# Altium schematic sheet Supply.SchDoc: Supply & POE
size 420 x 297 mm; Author: G.Kasprowicz; CompanyName: WUT ISE; DrawnBy: G.Kasprowicz; Organization: WUT ISE; Address1: PW ISE; Address2: Nowowiejska 15/19 00-665 Warsaw; Address3: gkasprow@gmail.com; DocumentNumber: 4; Revision: 2; SheetNumber: 4; SheetTotal: 5; ModifiedBy: -; CheckedDate: -; DivGrp: WUT ISE; Designer: G.Kasprowicz; ModifiedDate: -; ProjectName: Sensor Box
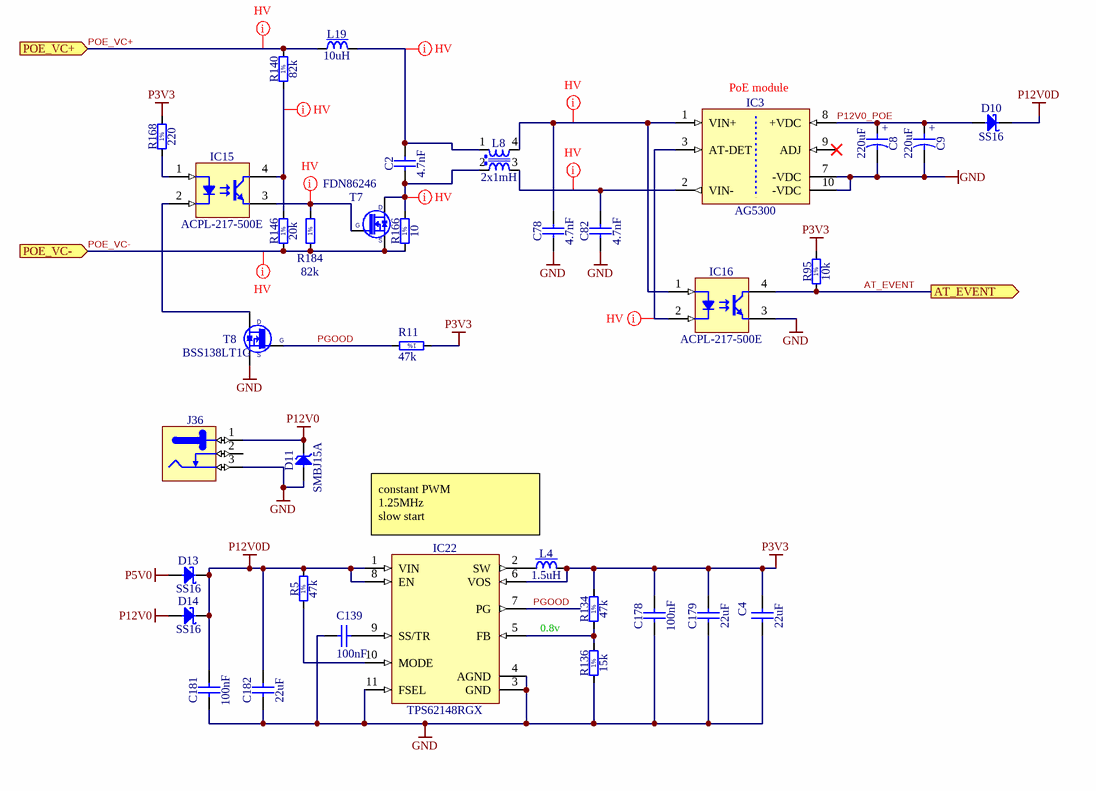
[diagram p0: Supply.SchDoc]

## Parts
C2  4.7nF  [CAPC3216X140N]
C4  22uF  [CAPC2012X135N]
C8  220uF  [CAPMP7343X430N]
C9  220uF  [CAPMP7343X430N]
C78  4.7nF  [CAPC3216X140N]
C82  4.7nF  [CAPC3216X140N]
C139  100nF  [CAPC1005X55N]
C178  100nF  [CAPC1005X55N]
C179  22uF  [CAPC2012X135N]
C181  100nF  [CAPC1005X55N]
C182  22uF  [CAPC2012X135N]
D10  SS16  [DIOM5127X229N]
D11  SMBJ15A  [DIOM5336X265N]
D13  SS16  [DIOM5127X229N]
D14  SS16  [DIOM5127X229N]
IC3  AG5300  [SILVERTEL_AG5300]
IC15  ACPL-217-500E  [SOIC127P700X242-4N]
IC16  ACPL-217-500E  [SOIC127P700X242-4N]
IC22  TPS62148RGX  [TEXAS_RGX0011A]
J36  Jack  [CLIFF_FC68148(DC-10A)]  (value not drawn)
L4  1.5uH  [IND_TDK_SPM6530]
L8  2x1mH  [IND_WURTH_WE-SL2]
L19  10uH  [IND_MURATA-PS_8400]
R5  47k  [RESC1608X55N]
R11  47k  [RESC1608X55N]
R95  10k  [RESC1005X40N]
R134  47k  [RESC1608X55N]
R136  15k  [RESC1608X55N]
R140  82k  [RESC1608X55N]
R146  20k  [RESC1005X40N]
R166  10  [RESC2012X60N]
R168  220  [RESC1608X55N]
R184  82k  [RESC1608X55N]
T7  FDN86246  [SOT95P237X112-3N]
T8  BSS138LT1G  [SOT95P240X110-3N]

## Ports
AT_EVENT (out), POE_VC+ (in), POE_VC- (in)

## Nets
GND: C4.1 C8.2 C9.2 C78.1 C82.1 C139.2 C178.1 C179.1 C181.1 C182.1 D11.2(A) IC3.7(-VDC) IC3.10(-VDC) IC16.3(E) IC22.3(GND) IC22.4(AGND) IC22.11(FSEL) J36.3 R136.1 T8.2(S)
P3V3: C4.2 C178.2 C179.2 IC22.6(VOS) L4.2 R11.1 R95.2 R134.2 R168.2
P5V0: D13.2(A)
P12V0: D11.1(C) D14.2(A) J36.1
P12V0D: C181.2 C182.2 D10.1(C) D13.1(C) D14.1(C) IC22.1(VIN) IC22.8(EN) R5.2
AT_EVENT: IC16.4(C) R95.1 ; port AT_EVENT
P12V0_POE: C8.1 C9.1 D10.2(A) IC3.8(+VDC)
PGOOD: IC22.7(PG) R11.2 T8.1(G)
POE_VC+: L19.1 R140.2 ; port POE_VC+
POE_VC-: R146.1 R166.1 R184.1 T7.2(S) ; port POE_VC-
NetC2_1: C2.1 L8.2 R166.2 T7.3(D)
NetC2_2: C2.2 L8.1 L19.2
NetC78_2: C78.2 IC3.1(VIN+) IC16.1(A) L8.4
NetC82_2: C82.2 IC3.2(VIN-) L8.3
NetC139_1: C139.1 IC22.9(SS/TR)
NetIC3_3: IC3.3(AT-DET) IC16.2(C)
NetIC15_1: IC15.1(A) R168.1
NetIC15_2: IC15.2(C) T8.3(D)
NetIC15_3: IC15.3(E) R184.2 T7.1(G)
NetIC15_4: IC15.4(C) R140.1 R146.2
NetIC22_2: IC22.2(SW) L4.1
NetIC22_5: IC22.5(FB) R134.1 R136.2
NetIC22_10: IC22.10(MODE) R5.1

Not connected (* = marked no-connect by the designer): IC3 9(ADJ)*; J36 2

## Layout directives
net class HV: NetC2_1, NetC2_2, NetC78_2, NetC82_2, NetIC3_3, NetIC15_3, NetIC15_4, POE_VC+, POE_VC-

## Notes on the sheet
- (near IC3) PoE module
- constant PWM
  1.25MHz
  slow start
- 0.8v
- Project/Equipment
- Document
- Designer
- Drawn by
- Check.by
- Copyright WUT ISE 2020.
  This documentation describes Open Hardware and is licensed under the CERN OHL v.1.2. You may redistribute and modify this documentation under the terms of the CERN OHL v.1.2. (http://ohwr.org/CERNOHL). This documentation is distributed WITHOUT ANY EXPRESS OR IMPLIED WARRANTY, INCLUDING OF MERCHANTABILITY, SATISFACTORY QUALITY AND FITNESS FOR A PARTICULAR PURPOSE. Please see the CERN OHL v.1.2 for applicable conditions.
- Contact
- File
- Last Mod.
- Print Date
- Sheet
- Size
- A3
- of
- Rev
- (in symbol CTE7343-43_220UF_16V_10%) +
- (in symbol R0402_10K_1%_0.0625W_100PPM) 1%
- (in symbol R0402_20K_1%_0.0625W_100PPM) 1%
- (in symbol R0603_15k_1%_0.1W_100PPM) 1%
- (in symbol R0603_47K_1%_0.1W_100PPM) 1%
- (in symbol R0603_82K_1%_0.1W_100PPM) 1%
- (in symbol R0603_220R_1%_0.1W_100PPM) 1%
- (in symbol R0805_10R_1%_0.125W_200PPM) 1%

## Library data of the parts
C2 C78 C82 = CAP_SMD_1206_4.7n_500V: Non-polarised capacitor; Part Number: CC1206_4.7NF_500V_10%_X7R; Part Description: SMD Multilayer Chip Ceramic Capacitor; Manufacturer: GENERIC; Manufacturer1 Part Number: C1206C472KCRACTU; Voltage: 500V; TC: X7R; Tolerance: ±10%; Table: Capacitors SMD; Component Kind: Standard; Component Type: Standard; Pin Count: 2; Value: 4.7nF; Status: Preferred; Manufacturer Part Number: CC1206_4.7NF_500V_10%_X7R; Case: 1206; Mounted: Yes; Socket: No; SMD: Yes; Manufacturer1 Example: KEMET; Manufacturer1 ComponentHeight: 1.7mm; HelpURL: \\cern.ch\dfs\Applications\Altium\Datasheets\CC1206_X7R_VISHAY_VJ.pdf; Author: GK; CreateDate: 2007-12-03; LatestRevisionDate: 2007-12-03
C4 C179 C182 = CC0805_22UF_16V_10%_X5R: Non-polarised capacitor; Part Description: SMD Multilayer Chip Ceramic Capacitor; Manufacturer: GENERIC; Manufacturer1 Part Number: C2012X5R1C226KT; Voltage: 16V; TC: X5R; Tolerance: ±10%; Part Number: CC0805_22UF_16V_10%_X5R; Component Kind: Standard; Component Type: Standard; Pin Count: 2; Value: 22uF; Status: Preferred; Manufacturer Part Number: CC0805_22UF_16V_10%_X5R; Case: 0805; Mounted: Yes; Socket: No; SMD: Yes; Sense: No; Manufacturer1 Example: TDK; Manufacturer1 ComponentHeight: 1.35mm; HelpURL: \\cern.ch\dfs\Applications\Altium\Datasheets\CC0805_X5R_TDK_C.pdf; Author: CERN DEM JLC; CreateDate: 25.10.2012; LatestRevisionDate: 25.10.2012
C8 C9 = CTE7343-43_220UF_16V_10%: Polarised capacitor; Part Description: Solid Tantalum Chip Capacitor; Manufacturer: GENERIC; Manufacturer1 Part Number: TAJE227K016R; Voltage: 16V; Tolerance: ±10%; Part Number: CTE7343-43_220UF_16V_10%; Component Kind: Standard; Component Type: Standard; Pin Count: 2; Value: 220uF; Status: Preferred; Manufacturer Part Number: CTE7343-43_220UF_16V_10%; Case: E; Mounted: Yes; Socket: No; SMD: Yes; Sense: No; Manufacturer1 Example: AVX; Manufacturer1 ComponentHeight: 4.3mm; HelpURL: \\cern.ch\dfs\Applications\Altium\Datasheets\CTE_AVX_TAJ.pdf; Author: CERN DEM JLC; CreateDate: 03.12.2007; LatestRevisionDate: 03.12.2007
C139 C178 C181 = CC0402_100NF_16V_10%_X5R: Non-polarised capacitor; Part Description: SMD Multilayer Chip Ceramic Capacitor; Manufacturer: GENERIC; Manufacturer1 Part Number: GRM155R61C104KA88D; Voltage: 16V; TC: X5R; Tolerance: ±10%; Part Number: CC0402_100NF_16V_10%_X5R; Component Kind: Standard; Component Type: Standard; Pin Count: 2; Value: 100nF; Status: None; Manufacturer Part Number: CC0402_100NF_16V_10%_X5R; Case: 0402; Mounted: Yes; Socket: No; SMD: Yes; Sense: No; Manufacturer1 Example: MURATA; Manufacturer1 ComponentHeight: 0.55mm; HelpURL: \\cern.ch\dfs\Applications\Altium\Datasheets\CC0402_X5R_MURATA_GRM.pdf; Author: CERN DEM JLC; CreateDate: 10.12.2013; LatestRevisionDate: 10.12.2013
D10 D13 D14 = SS16: Schottky Diode; Part Description: Surface Mount Schottky Barrier Rectifier; Manufacturer: VISHAY GENERAL SEMICONDUCTOR; Voltage: 60V; Power: 1A; PressFit: No; Bonding: No; Part Number: SS16; Component Kind: Standard; Component Type: Standard; Device: SS16; PackageDescription: DO-214-AC Molded Diode, Body 5.1x2.7mm, IPC Medium Density; Manufacturer Part Number: SS16; Pin Count: 2; Case: DO-214AC; Mounted: Yes; Socket: No; SMD: Yes; Sense: No; ComponentHeight: 2.29mm; HelpURL: \\cern.ch\dfs\Applications\Altium\Datasheets\SS16.pdf; Author: CERN DEM JLC; CreateDate: 15.07.2008; LatestRevisionDate: 23.08.2010
D11 = SMBJ15A: Zener Diode; Part Description: Uni-Directional Transient Voltage Suppressor Diode; Manufacturer: FAIRCHILD SEMICONDUCTOR; Voltage: 15V; Power: 600W; PressFit: No; Bonding: No; Part Number: SMBJ15A; Component Kind: Standard; Component Type: Standard; Device: SMBJ15A; PackageDescription: DO-214-AA/SMB Diode, Molded Body; 5.34mm L X 3.625mm W X 2.65mm H, IPC Medium Density; Manufacturer Part Number: SMBJ15A; Pin Count: 2; Case: DO-214AA; Mounted: Yes; Socket: No; SMD: Yes; Sense: No; ComponentHeight: 2.65mm; HelpURL: \\cern.ch\dfs\Applications\Altium\Datasheets\SMBJ.pdf; Author: CERN DEM JLC; CreateDate: 08.12.2008; LatestRevisionDate: 19.12.2011
IC3 = AG5300: Power-over-Ethernet Plus (POE+) Module; Part Description: 12V 30W Power-over-Ethernet Plus (POE+); Manufacturer: SILVERTEL; PressFit: No; Bonding: No; Part Number: AG5300; Component Kind: Standard; Component Type: Standard; Device: AG5300; PackageDescription: Power-over-Ethernet Plus (POE+) Module, Body L 57.3mm x W 18mm x H 14mm; Manufacturer Part Number: AG5300; Pin Count: 10; Mounted: Yes; Socket: No; SMD: No; Sense: No; ComponentHeight: 14mm; HelpURL: \\cern.ch\dfs\Applications\Altium\Datasheets\AG5300.pdf; Author: CERN DEM JLC; CreateDate: 20.03.2018; LatestRevisionDate: 20.03.2018
IC15 IC16 = ACPL-217-500E: Single Optocoupler; Part Description: DC Input, Half-Pitch Phototransistor Optocoupler; Manufacturer: AVAGO TECHNOLOGIES; PressFit: No; Bonding: No; Part Number: ACPL-217-500E; Component Kind: Standard; Component Type: Standard; Device: ACPL-217-500E; PackageDescription: SOIC, 1.27mm, pitch; 4 pin, 2.60mm W X 4.40mm L X 2.42mm H body, IPC Medium Density; Status: Not Recommended; Manufacturer Part Number: ACPL-217-500E; Pin Count: 4; Case: SOIC4; Mounted: Yes; Socket: No; SMD: Yes; Sense: No; ComponentHeight: 2.42mm; HelpURL: \\cern.ch\dfs\Applications\Altium\Datasheets\ACPL-217-500E.pdf; Author: CERN DEM JLC; CreateDate: 11.11.2014; LatestRevisionDate: 11.11.2014
IC22 = TPS62148RGX: 3V-17V 2A Step-Down Converter, High Accuracy, With DCS-Control; Manufacturer: TEXAS INSTRUMENTS; PressFit: No; Bonding: No; Part Number: TPS62148RGX; Component Kind: Standard; Component Type: Standard; Device: TPS62148RGX; PackageDescription: TEXAS Case Style (R-VQFN-HR-N11), 0.50mm Pitch, 11-pin, 2.00mm W X 3.00mm L X 1.00mm H Body; Part Description: 3V-17V 2A Step-Down Converter, High Accuracy, With DCS-Control; Manufacturer Part Number: TPS62148RGX; Pin Count: 11; Case: QFN14; Mounted: Yes; Socket: No; SMD: Yes; Sense: No; ComponentHeight: 1mm; HelpURL: \\cern.ch\dfs\Applications\Altium\Datasheets\TPS62148RGX.pdf; Author: CERN DEM MR; CreateDate: 08.02.2019; LatestRevisionDate: 08.02.2019
J36 = CLIFF_FC68148(DC-10A): 12V /  5A, 2.1mm Diameter Pin, DC Power Socket With  Switch. DC10A Type; Part Description: 12V/5A, 2.1mm Diameter Pin, DC Power Socket With  Switch (DC10A Type); Manufacturer: CLIFF ELECTRONIC COMPONENTS; PressFit: No; Part Number: CLIFF_FC68148(DC-10A); Component Kind: Standard; Component Type: Standard; Pin Count: 3; Family: Jack; Mounted: Yes; Socket: No; SMD: No; Sense: No; Status: None; Manufacturer Part Number: FC68148 (DC-10A); ComponentHeight: 11mm; HelpURL: \\cern.ch\dfs\Applications\Altium\Datasheets\CLIFF_FC68148(DC-10A).pdf; Author: CERN DEM JLC; CreateDate: 23/11/2010; LatestRevisionDate: 23/11/2010
L4 = IND_1.5UH_20%_TDK_SPM6530: Inductor With Core; Part Description: SMD Inductor for Power Circuits (Wound Metal), SPM Series; Manufacturer: TDK; Manufacturer Part Number: SPM6530T-1R5M100; Power: 11A; Resistance: 0.0097R; Tolerance: ±20%; Part Number: IND_1.5UH_20%_TDK_SPM6530; Component Kind: Standard; Component Type: Standard; Pin Count: 2; Value: 1.5uH; Status: None; Mounted: Yes; Socket: No; SMD: Yes; Sense: No; ComponentHeight: 3mm; HelpURL: \\cern.ch\dfs\Applications\Altium\Datasheets\IND_TDK_SPM6530.pdf; Author: CERN DEM MR; CreateDate: 08.11.2016; LatestRevisionDate: 08.11.2016
L8 = IND_1MH_50%_WURTH_WE-SL2-744222: Inductor Common Mode; Part Description: Common Mode SMD Line Filter (WE-SL2 Series); Manufacturer: WURTH ELEKTRONIK; Manufacturer Part Number: 744222; Power: 800mA; Resistance: 0.31R; Tolerance: ±50%; Part Number: IND_1MH_50%_WURTH_WE-SL2-744222; Component Kind: Standard; Component Type: Standard; Pin Count: 4; Value: 2x1mH; Status: None; Mounted: Yes; Socket: No; SMD: Yes; Sense: No; ComponentHeight: 5.3mm; HelpURL: \\cern.ch\dfs\Applications\Altium\Datasheets\IND_WURTH_WE-SL2_744222.pdf; Author: CERN DEM JLC; CreateDate: 04.06.2012; LatestRevisionDate: 15.10.2012
L19 = IND_10UH_10%_MURATA-PS_8400: Inductor With Core; Part Description: Miniature Surface Mount Power Inductor (8400 Serie); Manufacturer: MURATA POWER SOLUTIONS; Manufacturer Part Number: 84103C; Power: 950mA; Resistance: 0.24R; Tolerance: ±10%; Part Number: IND_10UH_10%_MURATA-PS_8400; Component Kind: Standard; Component Type: Standard; Pin Count: 2; Value: 10uH; Status: None; Mounted: Yes; Socket: No; SMD: Yes; Sense: No; ComponentHeight: 2.9mm; HelpURL: \\cern.ch\dfs\Applications\Altium\Datasheets\IND_MURATA-PS_8400.pdf; Author: CERN DEM JLC; CreateDate: 02.07.2012; LatestRevisionDate: 02.07.2012
R5 R11 R134 = R0603_47K_1%_0.1W_100PPM: Resistor - 1%; Part Description: General Purpose Thick Film Chip Resistor; Manufacturer: GENERIC; Manufacturer1 Part Number: NRC06F4702TRF; Power: 0.1W; TC: ±100ppm/°C; Part Number: R0603_47K_1%_0.1W_100PPM; Component Kind: Standard; Component Type: Standard; Pin Count: 2; Value: 47k; Status: Preferred; Tolerance: ±1%; Manufacturer Part Number: R0603_47K_1%_0.1W_100PPM; Case: 0603; Mounted: Yes; Sense: No; Socket: No; SMD: Yes; Manufacturer1 Example: NIC COMPONENT; Manufacturer1 ComponentHeight: 0.55mm; HelpURL: \\cern.ch\dfs\Applications\Altium\Datasheets\R0603_NIC_NRC.pdf; Author: CERN DEM JLC; CreateDate: 03.12.2007; LatestRevisionDate: 13.03.2008
R95 = R0402_10K_1%_0.0625W_100PPM: Resistor - 1%; Part Description: General Purpose Thick Film Chip Resistor; Manufacturer: GENERIC; Manufacturer1 Part Number: 232270671003L; TC: ±100ppm/°C; PressFit: No; Part Number: R0402_10K_1%_0.0625W_100PPM; Component Kind: Standard; Component Type: Standard; Pin Count: 2; Value: 10k; Status: Not Recommended; Power: 0.0625W; Tolerance: ±1%; Manufacturer Part Number: R0402_10K_1%_0.0625W_100PPM; Case: 0402; Mounted: Yes; Sense: No; Socket: No; SMD: Yes; Manufacturer1 Example: YAGEO PHYCOMP; Manufacturer1 ComponentHeight: 0.4mm; HelpURL: \\cern.ch\dfs\Applications\Altium\Datasheets\R0402_Phycomp_RC0402.pdf; Author: CERN DEM JLC; CreateDate: 03.12.2007; LatestRevisionDate: 17.10.2012
R136 = R0603_15k_1%_0.1W_100PPM: Resistor - 1%; Part Description: General Purpose Thick Film Chip Resistor; Manufacturer: GENERIC; Manufacturer1 Part Number: NRC06F1502TRF; Power: 0.1W; TC: ±100ppm/°C; PressFit: No; Part Number: R0603_15K_1%_0.1W_100PPM; Component Kind: Standard; Component Type: Standard; Pin Count: 2; Value: 15k; Status: Preferred; Tolerance: ±1%; Manufacturer Part Number: R0603_15K_1%_0.1W_100PPM; Case: 0603; Mounted: Yes; Sense: No; Socket: No; SMD: Yes; Manufacturer1 Example: NIC COMPONENT; Manufacturer1 ComponentHeight: 0.55mm; HelpURL: \\cern.ch\dfs\Applications\Altium\Datasheets\R0603_NIC_NRC.pdf; Author: CERN DEM JMW; CreateDate: 17/08/2015; LatestRevisionDate: 17/08/2015
R140 R184 = R0603_82K_1%_0.1W_100PPM: Resistor - 1%; Part Description: General Purpose Thick Film Chip Resistor; Manufacturer: GENERIC; Manufacturer1 Part Number: NRC06F8202TRF; Power: 0.1W; TC: ±100ppm/°C; Part Number: R0603_82K_1%_0.1W_100PPM; Component Kind: Standard; Component Type: Standard; Pin Count: 2; Value: 82k; Status: Preferred; Tolerance: ±1%; Manufacturer Part Number: R0603_82K_1%_0.1W_100PPM; Case: 0603; Mounted: Yes; Sense: No; Socket: No; SMD: Yes; Manufacturer1 Example: NIC COMPONENT; Manufacturer1 ComponentHeight: 0.55mm; HelpURL: \\cern.ch\dfs\Applications\Altium\Datasheets\R0603_NIC_NRC.pdf; Author: CERN DEM JLC; CreateDate: 03.12.2007; LatestRevisionDate: 13.03.2008
R146 = R0402_20K_1%_0.0625W_100PPM: Resistor - 1%; Part Description: General Purpose Thick Film Chip Resistor; Manufacturer: GENERIC; Manufacturer1 Part Number: 232270672003L; TC: ±100ppm/°C; PressFit: No; Part Number: R0402_20K_1%_0.0625W_100PPM; Component Kind: Standard; Component Type: Standard; Pin Count: 2; Value: 20k; Status: Not Recommended; Power: 0.0625W; Tolerance: ±1%; Manufacturer Part Number: R0402_20K_1%_0.0625W_100PPM; Case: 0402; Mounted: Yes; Sense: No; Socket: No; SMD: Yes; Manufacturer1 Example: YAGEO PHYCOMP; Manufacturer1 ComponentHeight: 0.4mm; HelpURL: \\cern.ch\dfs\Applications\Altium\Datasheets\R0402_Phycomp_RC0402.pdf; Author: CERN DEM JLC; CreateDate: 03.12.2007; LatestRevisionDate: 17.10.2012
R166 = R0805_10R_1%_0.125W_200PPM: Resistor - 1%; Part Description: General Purpose Thick Film Chip Resistor; Manufacturer: GENERIC; Manufacturer1 Part Number: NRC10F10R0TRF; Power: 0.125W; TC: ±200ppm/°C; PressFit: No; Part Number: R0805_10R_1%_0.125W_200PPM; Component Kind: Standard; Component Type: Standard; Pin Count: 2; Value: 10; Status: Preferred; Tolerance: ±1%; Manufacturer Part Number: R0805_10R_1%_0.125W_200PPM; Case: 0805; Mounted: Yes; Sense: No; Socket: No; SMD: Yes; Manufacturer1 Example: NIC COMPONENT; Manufacturer1 ComponentHeight: 0.6mm; HelpURL: \\cern.ch\dfs\Applications\Altium\Datasheets\R0805_NIC_NRC.pdf; Author: CERN DEM JLC; CreateDate: 03.12.2007; LatestRevisionDate: 24.06.2009
R168 = R0603_220R_1%_0.1W_100PPM: Resistor - 1%; Part Description: General Purpose Thick Film Chip Resistor; Manufacturer: GENERIC; Manufacturer1 Part Number: NRC06F2200TRF; Power: 0.1W; TC: ±100ppm/°C; Part Number: R0603_220R_1%_0.1W_100PPM; Component Kind: Standard; Component Type: Standard; Pin Count: 2; Value: 220; Status: Preferred; Tolerance: ±1%; Manufacturer Part Number: R0603_220R_1%_0.1W_100PPM; Case: 0603; Mounted: Yes; Sense: No; Socket: No; SMD: Yes; Manufacturer1 Example: NIC COMPONENT; Manufacturer1 ComponentHeight: 0.55mm; HelpURL: \\cern.ch\dfs\Applications\Altium\Datasheets\R0603_NIC_NRC.pdf; Author: CERN DEM JLC; CreateDate: 03.12.2007; LatestRevisionDate: 13.03.2008
T7 = FDN86246: N-CHANNEL MOSFET WITH DIODE; Part Description: 150V 1.6A N-Channel Power Trench® MOSFET; Manufacturer: ON SEMICONDUCTOR; PressFit: No; Bonding: No; Part Number: FDN86246; Component Kind: Standard; Component Type: Standard; Device: FDN86246; PackageDescription: SOT, 0.95mm, pitch; 3 pin,1.30mm W X 2.92mm L X 1.12mm H body, IPC Medium Density; Manufacturer Part Number: FDN86246; Pin Count: 3; Case: SOT23-3; Mounted: Yes; Socket: No; SMD: Yes; Sense: No; ComponentHeight: 1.12mm; HelpURL: \\cern.ch\dfs\Applications\Altium\Datasheets\FDN86246.pdf; ComponentLink1URL: \\cern.ch\dfs\Applications\Altium\Datasheets\FDN86246_Package.pdf; ComponentLink1Description: Package Drawing; Author: CERN DEM BC; CreateDate: 10.10.2019; LatestRevisionDate: 10.10.2019
T8 = BSS138LT1G: N-CHANNEL MOSFET WITH DIODE; Part Description: 50V 200mA N-Channel Enhancement Mode Field-Effect Transistor; Manufacturer: ON SEMICONDUCTOR; PressFit: No; Bonding: No; Part Number: BSS138LT1G; Component Kind: Standard; Component Type: Standard; Device: BSS138LT1G; PackageDescription: SOT23 3-Leads, Pitch 0.95mm - Body 1.4x3mm, IPC Medium Density; Manufacturer Part Number: BSS138LT1G; Pin Count: 3; Case: SOT23-3; Mounted: Yes; Socket: No; SMD: Yes; Sense: No; ComponentHeight: 1.11mm; HelpURL: \\cern.ch\dfs\Applications\Altium\Datasheets\BSS138LT1G.pdf; Author: CERN DEM JLC; CreateDate: 23.03.2009; LatestRevisionDate: 23.03.2009